# Altium schematic sheet FPGA_GPIO_Part1.SchDoc
size A4
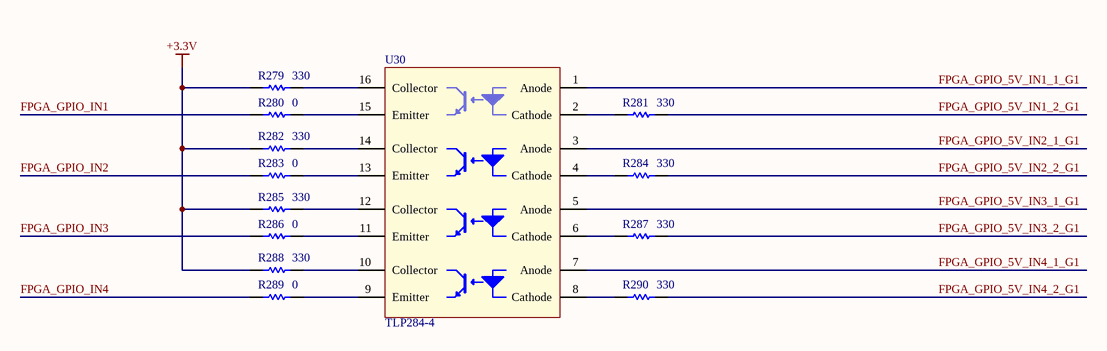
[diagram p0: FPGA_GPIO_Part1.SchDoc]

## Parts
R279  value 330  [1608[0603]]  (hidden comment: Res1)
R280  value 0  [1608[0603]]  (hidden comment: Res1)
R281  value 330  [1608[0603]]  (hidden comment: Res1)
R282  value 330  [1608[0603]]  (hidden comment: Res1)
R283  value 0  [1608[0603]]  (hidden comment: Res1)
R284  value 330  [1608[0603]]  (hidden comment: Res1)
R285  value 330  [1608[0603]]  (hidden comment: Res1)
R286  value 0  [1608[0603]]  (hidden comment: Res1)
R287  value 330  [1608[0603]]  (hidden comment: Res1)
R288  value 330  [1608[0603]]  (hidden comment: Res1)
R289  value 0  [1608[0603]]  (hidden comment: Res1)
R290  value 330  [1608[0603]]  (hidden comment: Res1)
U30  TLP284-4  [TLP284-4]

## Nets
+3.3V: R279.1 R282.1 R285.1 R288.1
FPGA_GPIO_5V_IN1_1_G1: U30.1(Anode)
FPGA_GPIO_5V_IN1_2_G1: R281.2
FPGA_GPIO_5V_IN2_1_G1: U30.3(Anode)
FPGA_GPIO_5V_IN2_2_G1: R284.2
FPGA_GPIO_5V_IN3_1_G1: U30.5(Anode)
FPGA_GPIO_5V_IN3_2_G1: R287.2
FPGA_GPIO_5V_IN4_1_G1: U30.7(Anode)
FPGA_GPIO_5V_IN4_2_G1: R290.2
FPGA_GPIO_IN1: R280.1
FPGA_GPIO_IN2: R283.1
FPGA_GPIO_IN3: R286.1
FPGA_GPIO_IN4: R289.1
NetR279_2: R279.2 U30.16(Collector)
NetR280_2: R280.2 U30.15(Emitter)
NetR281_1: R281.1 U30.2(Cathode)
NetR282_2: R282.2 U30.14(Collector)
NetR283_2: R283.2 U30.13(Emitter)
NetR284_1: R284.1 U30.4(Cathode)
NetR285_2: R285.2 U30.12(Collector)
NetR286_2: R286.2 U30.11(Emitter)
NetR287_1: R287.1 U30.6(Cathode)
NetR288_2: R288.2 U30.10(Collector)
NetR289_2: R289.2 U30.9(Emitter)
NetR290_1: R290.1 U30.8(Cathode)

## Library data of the parts
R279-R290 = Res1: Resistor; Published: 8-Jun-2000; LatestRevisionDate: 17-Jul-2002; LatestRevisionNote: Re-released for DXP Platform.; PackageReference: AXIAL-0.3; Publisher: Altium Limited; PackageDescription: Axial Device, Thru-Hole; 2 Leads; 0.3 in Pin Spacing